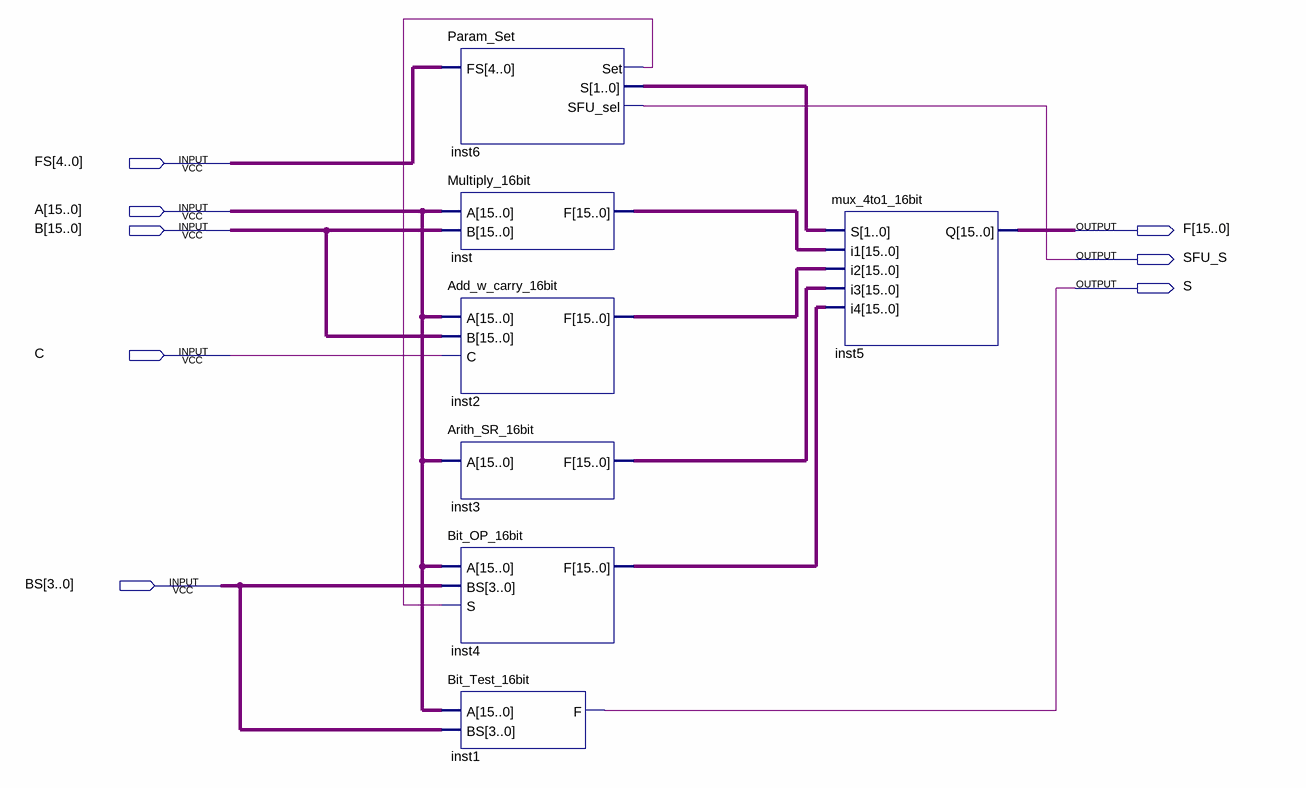
[diagram p0: schematic sheet]
// Quartus schematic SFU_16bit.bdf as structural Verilog: 7 symbols, 8 pins
module SFU_16bit (
  input  [4:0] FS,
  input  [15:0] A,
  input  [15:0] B,
  input  C,
  input  [3:0] BS,
  output [15:0] F,
  output SFU_S,
  output S
);

  wire inst6_set;
  wire [1:0] inst6_s;
  wire [15:0] inst2_f, inst3_f, inst4_f, inst_f;

  Param_Set inst6 (.FS(FS), .Set(inst6_set), .S(inst6_s), .SFU_sel(SFU_S));
  Multiply_16bit inst (.A(A), .B(B), .F(inst_f));
  Add_w_carry_16bit inst2 (.A(A), .B(B), .C(C), .F(inst2_f));
  Arith_SR_16bit inst3 (.A(A), .F(inst3_f));
  Bit_OP_16bit inst4 (.A(A), .BS(BS), .S(inst6_set), .F(inst4_f));
  Bit_Test_16bit inst1 (.A(A), .BS(BS), .F(S));
  mux_4to1_16bit inst5 (.S(inst6_s), .i1(inst_f), .i2(inst2_f), .i3(inst3_f), .i4(inst4_f), .Q(F));
endmodule
